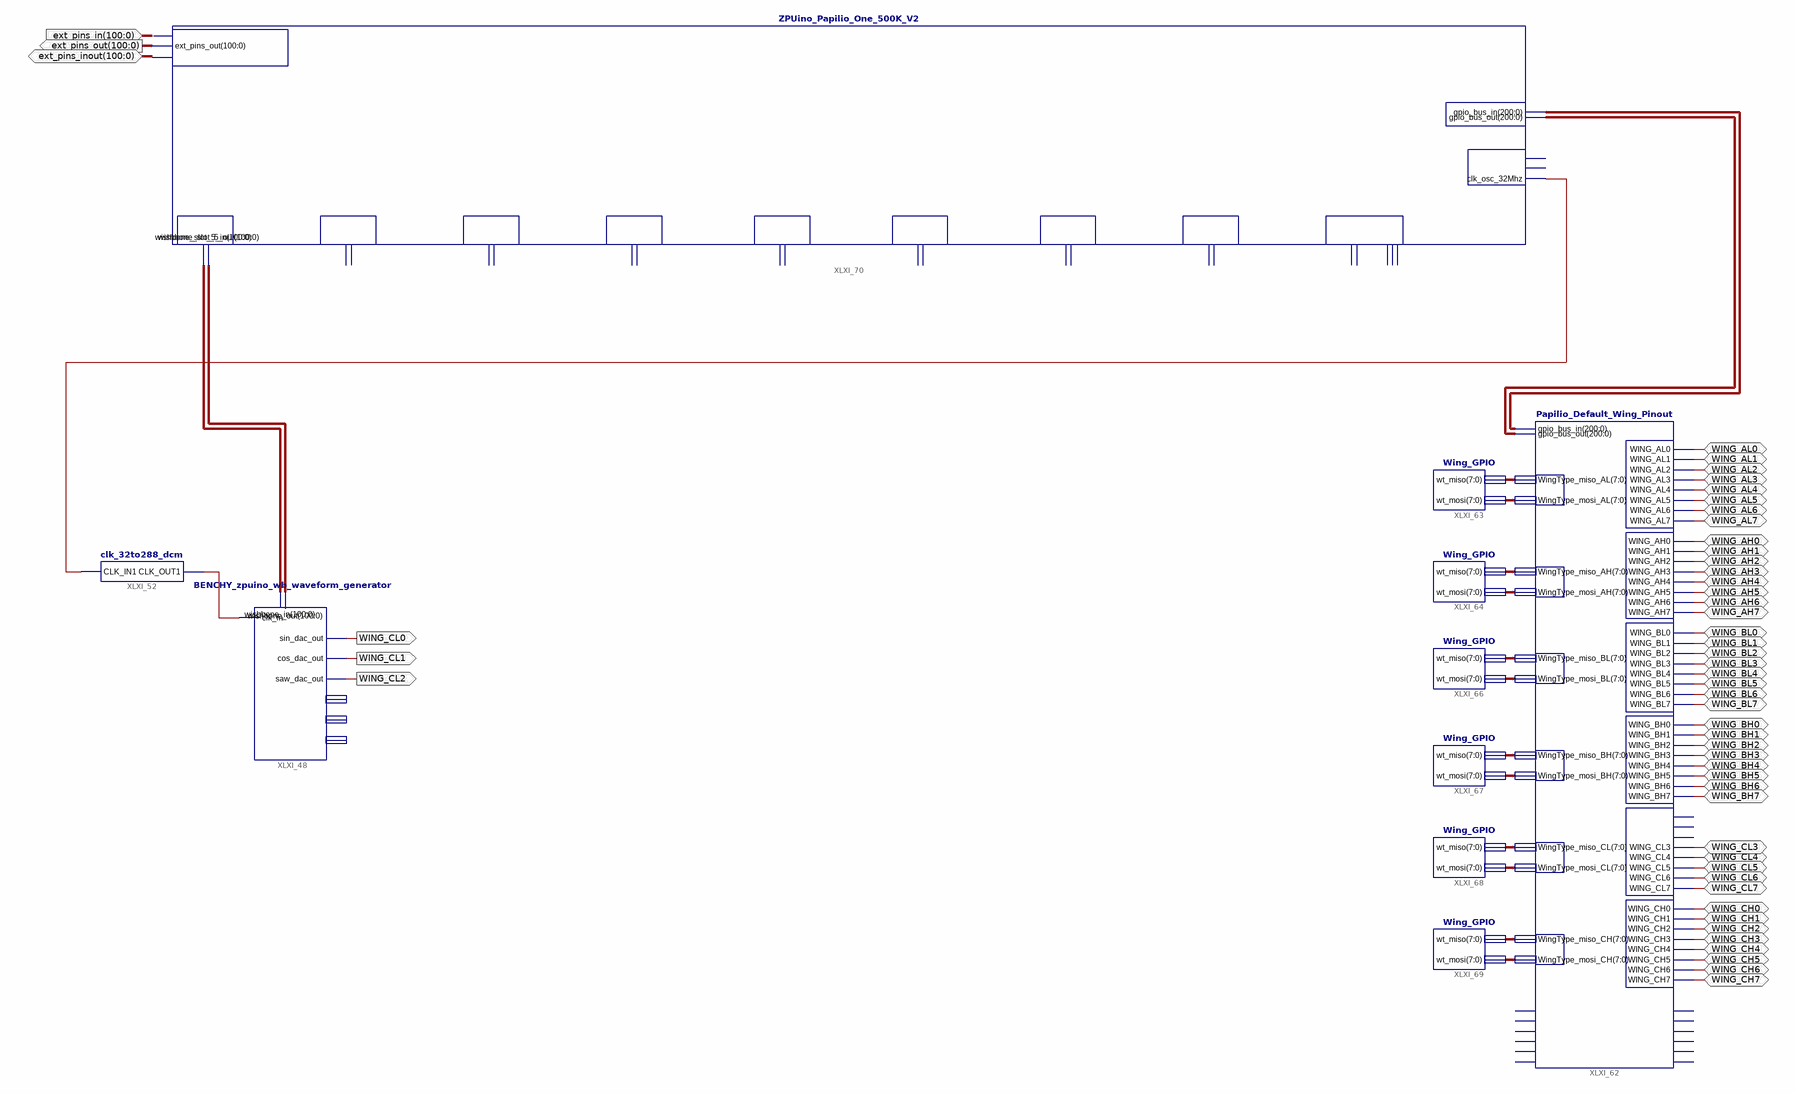
[diagram p0: schematic sheet 1]
// Xilinx ISE schematic Papilio_One_500K.sch (spartan3e) as structural Verilog: 10 symbols, 51 ports
module Papilio_One_500K (
  input  [100:0] ext_pins_in,
  inout  WING_AL0,
  inout  WING_AL1,
  inout  WING_AL2,
  inout  WING_AL3,
  inout  WING_AL4,
  inout  WING_AL5,
  inout  WING_AL6,
  inout  WING_AL7,
  inout  WING_AH0,
  inout  WING_AH1,
  inout  WING_AH2,
  inout  WING_AH3,
  inout  WING_AH4,
  inout  WING_AH5,
  inout  WING_AH6,
  inout  WING_AH7,
  inout  WING_BL0,
  inout  WING_BL1,
  inout  WING_BL2,
  inout  WING_BL3,
  inout  WING_BL4,
  inout  WING_BL5,
  inout  WING_BL6,
  inout  WING_BL7,
  inout  WING_BH0,
  inout  WING_BH1,
  inout  WING_BH2,
  inout  WING_BH3,
  inout  WING_BH4,
  inout  WING_BH5,
  inout  WING_BH6,
  inout  WING_BH7,
  inout  WING_CH0,
  inout  WING_CH1,
  inout  WING_CH2,
  inout  WING_CH3,
  inout  WING_CH4,
  inout  WING_CH5,
  inout  WING_CH6,
  inout  WING_CH7,
  inout  WING_CL4,
  inout  WING_CL5,
  inout  WING_CL6,
  inout  WING_CL7,
  inout  WING_CL3,
  inout  [100:0] ext_pins_inout,
  output WING_CL0,
  output WING_CL1,
  output WING_CL2,
  output [100:0] ext_pins_out
);

  wire XLXN_466, XLXN_475;
  wire [7:0] XLXN_498, XLXN_499, XLXN_500, XLXN_501, XLXN_502, XLXN_503, XLXN_504, XLXN_505, XLXN_506,
       XLXN_507, XLXN_508, XLXN_509;
  wire [100:0] XLXN_513, XLXN_514;
  wire [200:0] XLXN_408, XLXN_409;

  BENCHY_zpuino_wb_waveform_generator XLXI_48 (
    .saw_dac_out(WING_CL2), .sin_dac_out(WING_CL0), .cos_dac_out(WING_CL1), .clk_in(XLXN_475),
    .wishbone_in(XLXN_513), .wishbone_out(XLXN_514));  // open: saw_out, sin_out, cos_out
  clk_32to288_dcm XLXI_52 (.CLK_IN1(XLXN_466), .CLK_OUT1(XLXN_475));
  Papilio_Default_Wing_Pinout XLXI_62 (
    .WING_AH0(WING_AH0), .WING_AH1(WING_AH1), .WING_AH2(WING_AH2), .WING_AH3(WING_AH3), .WING_AH4(WING_AH4),
    .WING_AH5(WING_AH5), .WING_AH6(WING_AH6), .WING_AH7(WING_AH7), .WING_AL0(WING_AL0), .WING_AL1(WING_AL1),
    .WING_AL2(WING_AL2), .WING_AL3(WING_AL3), .WING_AL4(WING_AL4), .WING_AL5(WING_AL5), .WING_AL6(WING_AL6),
    .WING_AL7(WING_AL7), .WING_BH0(WING_BH0), .WING_BH1(WING_BH1), .WING_BH2(WING_BH2), .WING_BH3(WING_BH3),
    .WING_BH4(WING_BH4), .WING_BH5(WING_BH5), .WING_BH6(WING_BH6), .WING_BH7(WING_BH7), .WING_BL0(WING_BL0),
    .WING_BL1(WING_BL1), .WING_BL2(WING_BL2), .WING_BL3(WING_BL3), .WING_BL4(WING_BL4), .WING_BL5(WING_BL5),
    .WING_BL6(WING_BL6), .WING_BL7(WING_BL7), .WING_CL3(WING_CL3), .WING_CL4(WING_CL4), .WING_CL5(WING_CL5),
    .WING_CL6(WING_CL6), .WING_CL7(WING_CL7), .WING_CH0(WING_CH0), .WING_CH1(WING_CH1), .WING_CH2(WING_CH2),
    .WING_CH3(WING_CH3), .WING_CH4(WING_CH4), .WING_CH5(WING_CH5), .WING_CH6(WING_CH6), .WING_CH7(WING_CH7),
    .gpio_bus_out(XLXN_408), .gpio_bus_in(XLXN_409), .WingType_miso_BH(XLXN_504),
    .WingType_miso_BL(XLXN_502), .WingType_miso_AH(XLXN_500), .WingType_mosi_BL(XLXN_503),
    .WingType_mosi_BH(XLXN_505), .WingType_mosi_CL(XLXN_507), .WingType_mosi_AH(XLXN_501),
    .WingType_miso_CL(XLXN_506), .WingType_miso_CH(XLXN_508), .WingType_mosi_CH(XLXN_509),
    .WingType_mosi_AL(XLXN_499), .WingType_miso_AL(XLXN_498));  // open: WING_CL0, WING_CL1, WING_CL2, Flex_Pin_out_0, Flex_Pin_out_1, Flex_Pin_out_2, Flex_Pin_out_3, Flex_Pin_out_4, Flex_Pin_out_5, Flex_Pin_in_0, Flex_Pin_in_1, Flex_Pin_in_2, Flex_Pin_in_3, Flex_Pin_in_4, Flex_Pin_in_5
  Wing_GPIO XLXI_63 (.wt_miso(XLXN_498), .wt_mosi(XLXN_499));
  Wing_GPIO XLXI_64 (.wt_miso(XLXN_500), .wt_mosi(XLXN_501));
  Wing_GPIO XLXI_66 (.wt_miso(XLXN_502), .wt_mosi(XLXN_503));
  Wing_GPIO XLXI_67 (.wt_miso(XLXN_504), .wt_mosi(XLXN_505));
  Wing_GPIO XLXI_68 (.wt_miso(XLXN_506), .wt_mosi(XLXN_507));
  Wing_GPIO XLXI_69 (.wt_miso(XLXN_508), .wt_mosi(XLXN_509));
  ZPUino_Papilio_One_500K_V2 XLXI_70 (
    .clk_osc_32Mhz(XLXN_466), .ext_pins_in(ext_pins_in), .ext_pins_out(ext_pins_out),
    .ext_pins_inout(ext_pins_inout), .gpio_bus_out(XLXN_408), .gpio_bus_in(XLXN_409),
    .wishbone_slot_5_out(XLXN_514), .wishbone_slot_5_in(XLXN_513));  // open: clk_96Mhz, clk_1Mhz, wishbone_slot_6_in, wishbone_slot_6_out, wishbone_slot_8_in, wishbone_slot_8_out, wishbone_slot_9_in, wishbone_slot_9_out, wishbone_slot_10_in, wishbone_slot_10_out, wishbone_slot_11_in, wishbone_slot_11_out, wishbone_slot_12_in, wishbone_slot_12_out, wishbone_slot_13_in, wishbone_slot_13_out, wishbone_slot_14_in, wishbone_slot_14_out, wishbone_slot_video_in, wishbone_slot_video_out, vgaclkout
endmodule
